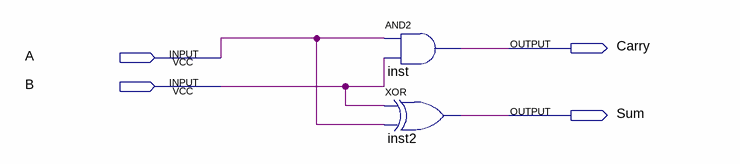
[diagram p0: schematic sheet]
// Quartus schematic halfadder.bdf as structural Verilog: 2 symbols, 4 pins
module halfadder (
  input  A,
  input  B,
  output Carry,
  output Sum
);

  and inst (Carry, A, B);
  xor inst2 (Sum, B, A);
endmodule
